# EAGLE schematic KGGRdac (EAGLE 8.2.1)

## Sheet 1 of 3
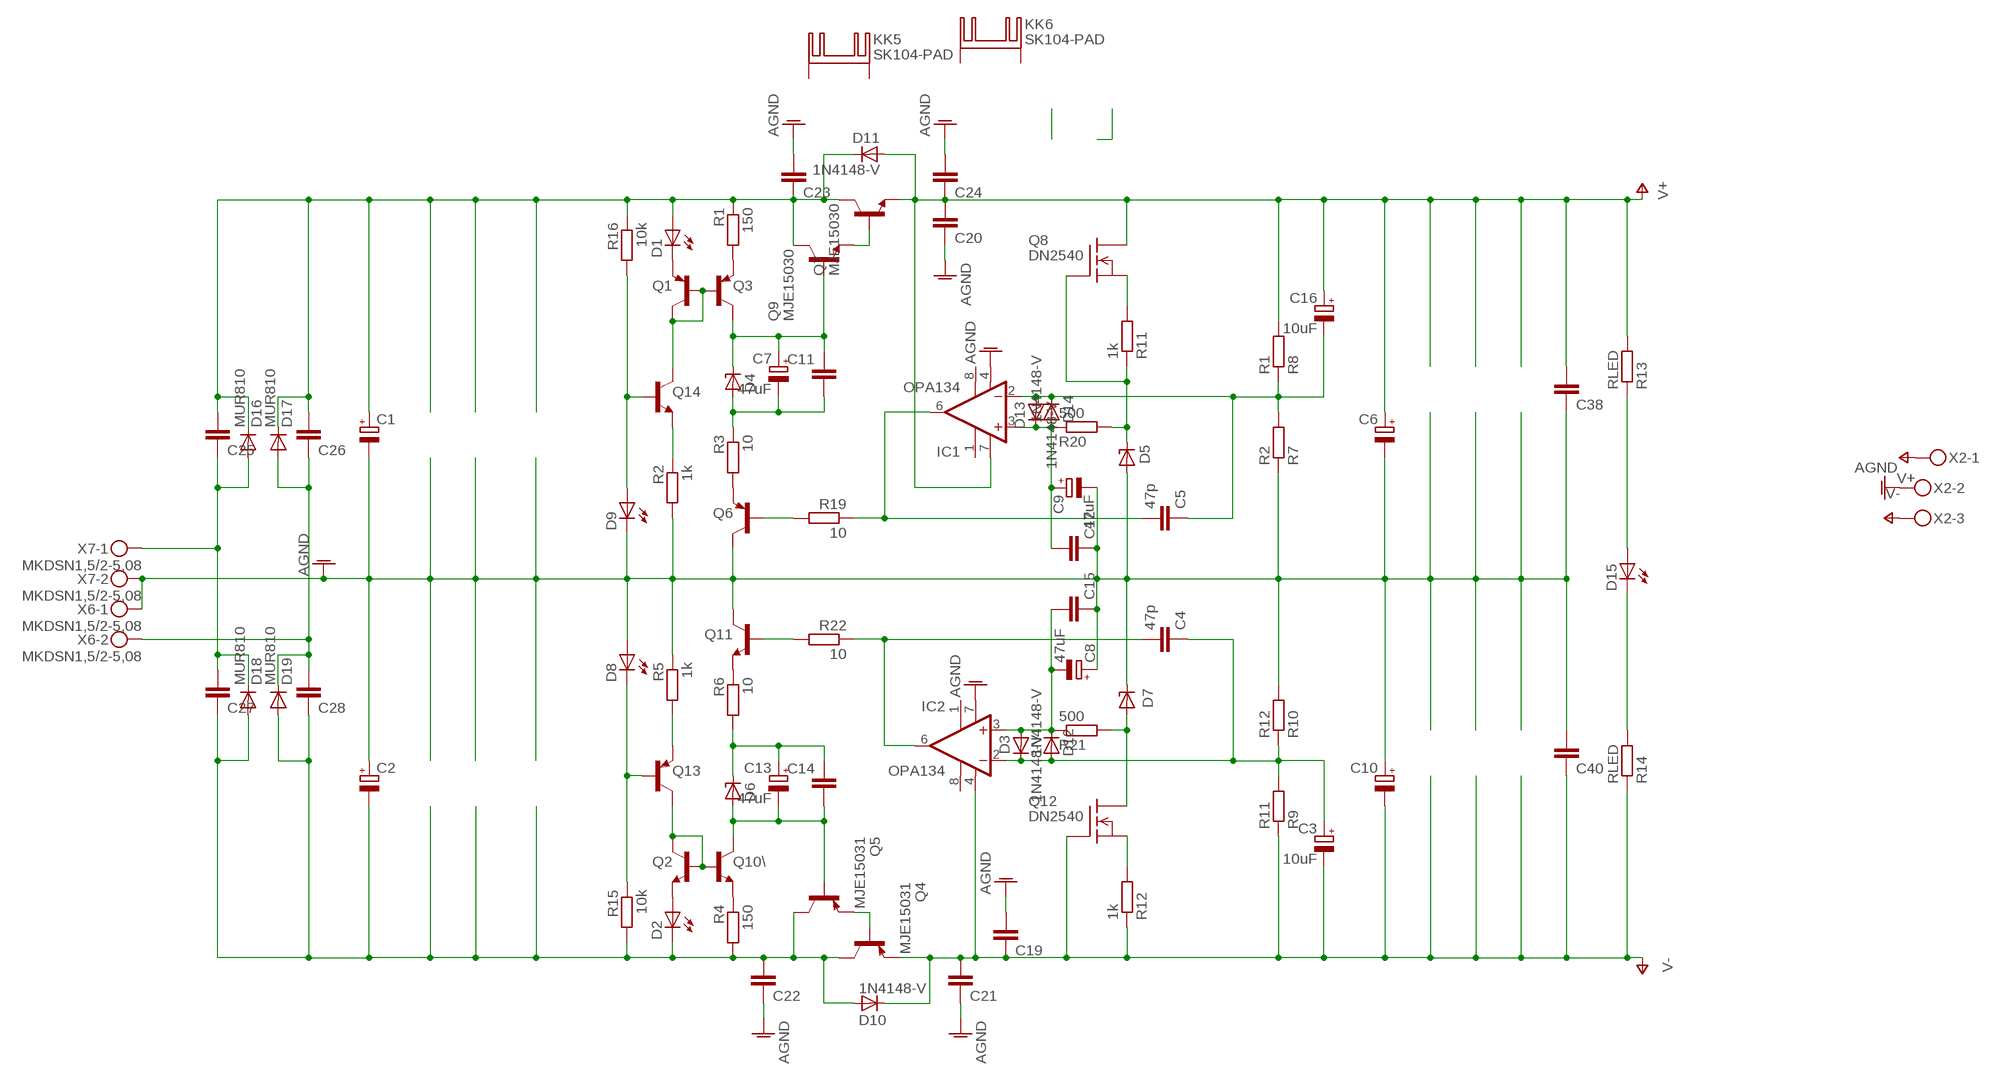
[diagram p0: schematic, sheet 1]

### Parts
C1  CPOL-EUE10-35  [EB35D]
C2  CPOL-EUE10-35  [EB35D]
C3  10uF  CPOL-EUSP-CAP-CX  [SP-CAP-CX]
C4  47p  C-EUC1206  [C1206]
C5  47p  C-EUC1206  [C1206]
C6  CPOL-EUE5-13  [E5-13]
C7  47uF  CPOL-EUSP-CAP-CX  [SP-CAP-CX]
C8  47uF  CPOL-EUSP-CAP-CX  [SP-CAP-CX]
C9  47uF  CPOL-EUSP-CAP-CX  [SP-CAP-CX]
C10  CPOL-EUE5-13  [E5-13]
C11  C-EUC1206  [C1206]
C12  C-EU050-035X075  [C050-035X075]
C13  47uF  CPOL-EUSP-CAP-CX  [SP-CAP-CX]
C14  C-EUC1206  [C1206]
C15  C-EU050-035X075  [C050-035X075]
C16  10uF  CPOL-EUSP-CAP-CX  [SP-CAP-CX]
C19  C-EU050-035X075  [C050-035X075]
C20  C-EU050-035X075  [C050-035X075]
C21  C-EU050-035X075  [C050-035X075]
C22  C-EU050-075X075  [C050-075X075]
C23  C-EU050-075X075  [C050-075X075]
C24  C-EU050-035X075  [C050-035X075]
C25  C-EU050-035X075  [C050-035X075]
C26  C-EU050-035X075  [C050-035X075]
C27  C-EU050-035X075  [C050-035X075]
C28  C-EU050-035X075  [C050-035X075]
C38  C-EU050-035X075  [C050-035X075]
C40  C-EU050-035X075  [C050-035X075]
D1  LED5MM  [LED5MM]
D2  LED5MM  [LED5MM]
D3  1N4148-V  [1N4148]
D4  1N4728  [DO41Z10]
D5  LT1021  LT1021-V  [DIL08]
D6  1N4728  [DO41Z10]
D7  LT1021  LT1021-V  [DIL08]
D8  LED5MM  [LED5MM]
D9  LED5MM  [LED5MM]
D10  1N4148-V  [1N4148]
D11  1N4148-V  [1N4148]
D12  1N4148-V  [1N4148]
D13  1N4148-V  [1N4148]
D14  1N4148-V  [1N4148]
D15  LED5MM  [LED5MM]
D16  MUR810  [TO220ACS]
D17  MUR810  [TO220ACS]
D18  MUR810  [TO220ACS]
D19  MUR810  [TO220ACS]
IC1  OPA134  OPA134P  [DIL08]
IC2  OPA134  OPA134P  [DIL08]
KK5  SK104-PAD  [SK104-PAD]
KK6  SK104-PAD  [SK104-PAD]
Q1  MPSA92-PNP-TO92-EBC  [TO92-EBC]
Q2  MPSA42-NPN-TO92-EBC  [TO92-EBC]
Q3  MPSA92-PNP-TO92-EBC  [TO92-EBC]
Q4  MJE15031  [TO220KG]
Q5  MJE15031  [TO220KG]
Q6  MPSA92-PNP-TO92-EBC  [TO92-EBC]
Q7  MJE15030  [TO220KG]
Q8  DN2540  2N7000TO92  [TO92-]
Q9  MJE15030  [TO220KG]
Q10\  MPSA42-NPN-TO92-EBC  [TO92-EBC]
Q11  MPSA42-NPN-TO92-EBC  [TO92-EBC]
Q12  DN2540  2N7000TO92  [TO92-]
Q13  MPSA92-PNP-TO92-EBC  [TO92-EBC]
Q14  MPSA42-NPN-TO92-EBC  [TO92-EBC]
R1  150  R-EU_0207/2V  [0207/2V]
R2  1k  R-EU_0207/2V  [0207/2V]
R3  10  R-EU_0207/2V  [0207/2V]
R4  150  R-EU_0207/2V  [0207/2V]
R5  1k  R-EU_0207/2V  [0207/2V]
R6  10  R-EU_0207/2V  [0207/2V]
R7  R2  R-EU_0207/2V  [0207/2V]
R8  R1  R-EU_0207/2V  [0207/2V]
R9  R11  R-EU_0207/2V  [0207/2V]
R10  R12  R-EU_0207/2V  [0207/2V]
R11  1k  R-EU_0207/2V  [0207/2V]
R12  1k  R-EU_0207/2V  [0207/2V]
R13  RLED  R-EU_0207/2V  [0207/2V]
R14  RLED  R-EU_0207/2V  [0207/2V]
R15  10k  R-EU_0207/2V  [0207/2V]
R16  10k  R-EU_0207/2V  [0207/2V]
R19  10  R-EU_0207/2V  [0207/2V]
R20  500  R-EU_0207/2V  [0207/2V]
R21  500  R-EU_0207/2V  [0207/2V]
R22  10  R-EU_0207/2V  [0207/2V]
X2  MKDSN1,5/3-5,08  [MKDSN1,5/3-5,08]
X6  MKDSN1,5/2-5,08  [MKDSN1,5/2-5,08]
X7  MKDSN1,5/2-5,08  [MKDSN1,5/2-5,08]

### Nets
AGND: C1.- C2.+ C6.- C8.+ C9.- C10.+ C12.1 C15.1 C19.2 C20.1 C21.1 C22.1 C23.2 C24.2 C38.1 C40.2 D5.4(GND) D7.6(OUT) D8.A D9.K(C) IC1.4(V-) IC2.7(V+) Q6.C Q11.C R2.2 R5.1 R7.1 R10.2 X2.2 X6.1 X7.2
N$1: Q1.B Q1.C Q3.B Q14.C
N$2: D1.K(C) Q1.E
N$3: Q3.E R1.2
N$4: C1.+ C23.1 C25.2 C26.2 D1.A D11.C D16.C D17.C Q7.2(C) Q9.2(C) R1.1 R16.1
N$5: C7.+ C11.1 D4.C Q3.C Q9.1(B)
N$6: C7.- C11.2 D4.A R3.1
N$7: Q6.E R3.2
N$8: Q14.E R2.1
N$9: D9.A Q14.B R16.2
N$10: C8.- C15.2 D3.A D12.C IC2.3(+IN) R21.1
N$11: Q13.E R5.2
N$12: D8.K(C) Q13.B R15.1
N$13: Q11.E R6.1
N$14: C13.+ C14.1 D6.C R6.2
N$15: C13.- C14.2 D6.A Q5.1(B) Q10\.C
N$16: Q2.B Q2.C Q10\.B Q13.C
N$17: Q4.1(B) Q5.3(E)
N$18: Q10\.E R4.1
N$19: D2.A Q2.E
N$21: Q7.1(B) Q9.3(E)
N$22: C2.- C22.2 C27.1 C28.1 D2.K(C) D10.A D18.A D19.A Q4.2(C) Q5.2(C) R4.2 R15.2
N$23: C25.1 C27.2 D16.A D18.C X7.1
N$24: C5.2 IC1.6(OUT) R19.1
N$25: C4.2 IC2.6(OUT) R22.1
N$26: Q11.B R22.2
N$27: Q6.B R19.2
N$28: C5.1 C16.- D13.A D14.C IC1.2(-IN) R7.2 R8.1
N$29: Q12.3(S) R12.2
N$30: D5.6(OUT) Q8.2(G) R11.1 R20.2
N$31: C9.+ C12.2 D13.C D14.A IC1.3(+IN) R20.1
N$32: D15.K(C) R14.2
N$33: D7.4(GND) Q12.1(D) R21.2
N$34: C3.+ C4.1 D3.C D12.A IC2.2(-IN) R9.2 R10.1
N$35: Q8.3(S) R11.2
N$36: D15.A R13.1
N$38: C26.1 C28.2 D17.A D19.C X6.2
V+: C6.+ C16.+ C20.2 C24.1 C38.2 D11.A IC1.7(V+) Q7.3(E) Q8.1(D) R8.2 R13.2 X2.1
V-: C3.- C10.- C19.1 C21.2 C40.1 D10.C IC2.4(V-) Q4.3(E) Q12.2(G) R9.1 R12.1 R14.1 X2.3
Unconnected: IC1.1(TRIM1) IC1.8(TRIM2) IC2.1(TRIM1) IC2.8(TRIM2) KK5.K1(K) KK5.K2(K) KK6.K1(K) KK6.K2(K)

## Sheet 2 of 3
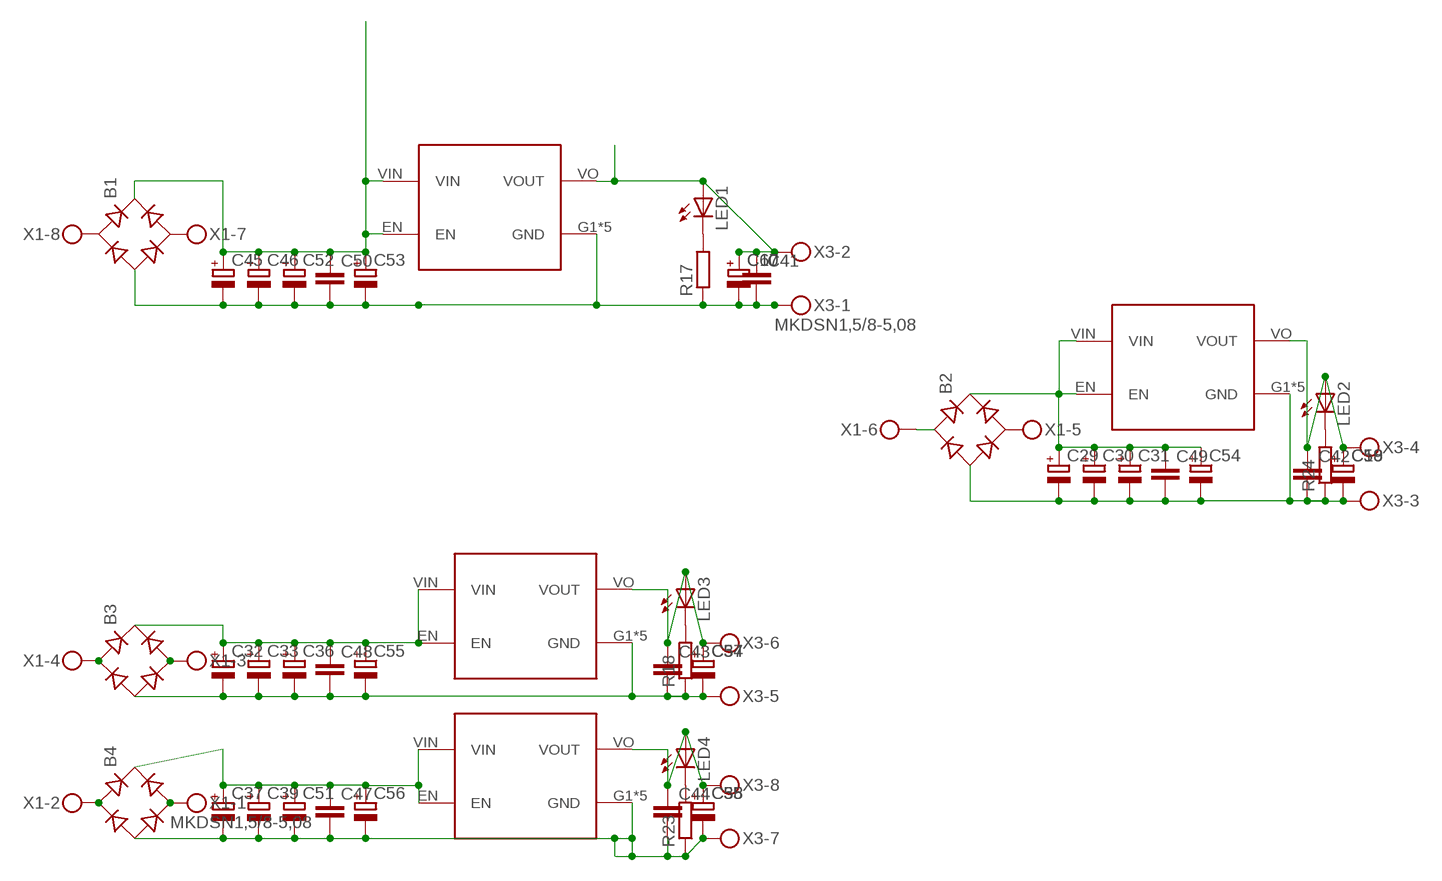
[diagram p1: schematic, sheet 2]

### Parts
B1  RB1A  [RB1A]
B2  RB1A  [RB1A]
B3  RB1A  [RB1A]
B4  RB1A  [RB1A]
C17  CPOL-EUSP-CAP-CX  [SP-CAP-CX]
C18  CPOL-EUSP-CAP-CX  [SP-CAP-CX]
C29  CPOL-EUSP-CAP-CX  [SP-CAP-CX]
C30  CPOL-EUSP-CAP-CX  [SP-CAP-CX]
C31  CPOL-EUSP-CAP-CX  [SP-CAP-CX]
C32  CPOL-EUSP-CAP-CX  [SP-CAP-CX]
C33  CPOL-EUSP-CAP-CX  [SP-CAP-CX]
C34  CPOL-EUSP-CAP-CX  [SP-CAP-CX]
C35  CPOL-EUSP-CAP-CX  [SP-CAP-CX]
C36  CPOL-EUSP-CAP-CX  [SP-CAP-CX]
C37  CPOL-EUSP-CAP-CX  [SP-CAP-CX]
C39  CPOL-EUSP-CAP-CX  [SP-CAP-CX]
C41  C-EUC1206  [C1206]
C42  C-EUC1206  [C1206]
C43  C-EUC1206  [C1206]
C44  C-EUC1206  [C1206]
C45  CPOL-EUSP-CAP-CX  [SP-CAP-CX]
C46  CPOL-EUSP-CAP-CX  [SP-CAP-CX]
C47  C-EUC1206  [C1206]
C48  C-EUC1206  [C1206]
C49  C-EUC1206  [C1206]
C50  C-EUC1206  [C1206]
C51  CPOL-EUSP-CAP-CX  [SP-CAP-CX]
C52  CPOL-EUSP-CAP-CX  [SP-CAP-CX]
C53  CPOL-EUSP-CAP-CX  [SP-CAP-CX]
C54  CPOL-EUSP-CAP-CX  [SP-CAP-CX]
C55  CPOL-EUSP-CAP-CX  [SP-CAP-CX]
C56  CPOL-EUSP-CAP-CX  [SP-CAP-CX]
C57  CPOL-EUSP-CAP-CX  [SP-CAP-CX]
C58  CPOL-EUSP-CAP-CX  [SP-CAP-CX]
C59  CPOL-EUSP-CAP-CX  [SP-CAP-CX]
C60  CPOL-EUSP-CAP-CX  [SP-CAP-CX]
LED1  LEDSML0805  [SML0805]
LED2  LEDSML0805  [SML0805]
LED3  LEDSML0805  [SML0805]
LED4  LEDSML0805  [SML0805]
R17  R-EU_MELF0204W  [MINI_MELF-0204W]
R18  R-EU_MELF0204W  [MINI_MELF-0204W]
R23  R-EU_MELF0204W  [MINI_MELF-0204W]
R24  R-EU_MELF0204W  [MINI_MELF-0204W]
U$3  POWER-MO  [POWER-MO]
U$4  POWER-MO  [POWER-MO]
U$5  POWER-MO  [POWER-MO]
U$6  POWER-MO  [POWER-MO]
X1  MKDSN1,5/8-5,08  [MKDSN1,5/8-5,08]
X3  MKDSN1,5/8-5,08  [MKDSN1,5/8-5,08]

### Nets
N$43: B2.+ C29.+ C30.+ C31.+ C49.1 C54.+ U$3.EN U$3.VIN
N$44: B2.- C18.- C29.- C30.- C31.- C42.2 C49.2 C54.- C59.- R24.1 U$3.G1(GND) U$3.G2(GND) U$3.G3(GND) U$3.G4(GND) U$3.G5(GND) X3.3
N$46: B4.+ C37.+ C39.+ C47.1 C51.+ C56.+ U$6.EN U$6.VIN
N$47: B4.- C35.- C37.- C39.- C44.2 C47.2 C51.- C56.- C58.- R23.1 U$6.G1(GND) U$6.G2(GND) U$6.G3(GND) U$6.G4(GND) U$6.G5(GND) X3.7
N$48: C35.+ C44.1 C58.+ LED4.A U$6.VO(VOUT) X3.8
N$49: C34.+ C43.1 C57.+ LED3.A U$5.VO(VOUT) X3.6
N$50: C18.+ C42.1 C59.+ LED2.A U$3.VO(VOUT) X3.4
N$51: B3.AC1 X1.4
N$52: B3.AC2 X1.3
N$53: B4.AC1 X1.2
N$54: B4.AC2 X1.1
N$55: B3.- C32.- C33.- C34.- C36.- C43.2 C48.2 C55.- C57.- R18.1 U$5.G1(GND) U$5.G2(GND) U$5.G3(GND) U$5.G4(GND) U$5.G5(GND) X3.5
N$56: B1.AC2 X1.7
N$57: B1.AC1 X1.8
N$58: B1.+ C45.+ C46.+ C50.1 C52.+ C53.+ U$4.EN U$4.VIN
N$59: B2.AC2 X1.5
N$61: B2.AC1 X1.6
N$62: B3.+ C32.+ C33.+ C36.+ C48.1 C55.+ U$5.EN U$5.VIN
N$65: B1.- C17.- C41.2 C45.- C46.- C50.2 C52.- C53.- C60.- R17.1 U$4.G1(GND) U$4.G2(GND) U$4.G3(GND) U$4.G4(GND) U$4.G5(GND) X3.1
N$66: C17.+ C41.1 C60.+ LED1.A U$4.VO(VOUT) X3.2
N$67: LED1.C R17.2
N$71: LED4.C R23.2
N$72: LED3.C R18.2
N$73: LED2.C R24.2

## Sheet 3 of 3
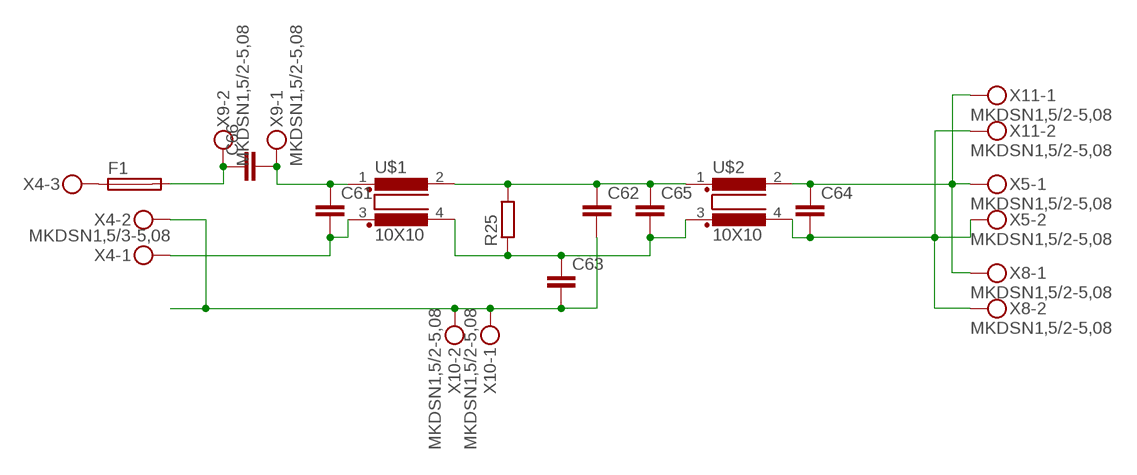
[diagram p2: schematic, sheet 3]

### Parts
C61  C-EU225-087X268  [C225-087X268]
C62  C-EU102-054X133  [C102-054X133]
C63  C-EU102-054X133  [C102-054X133]
C64  C-EU225-087X268  [C225-087X268]
C65  C-EU225-087X268  [C225-087X268]
C66  C-EU075-042X103  [C075-042X103]
F1  SH22,5A  [SH22,5A]
R25  R-EU_0411/15  [0411/15]
U$1  10X10  [10X10]
U$2  10X10  [10X10]
X4  MKDSN1,5/3-5,08  [MKDSN1,5/3-5,08]
X5  MKDSN1,5/2-5,08  [MKDSN1,5/2-5,08]
X8  MKDSN1,5/2-5,08  [MKDSN1,5/2-5,08]
X9  MKDSN1,5/2-5,08  [MKDSN1,5/2-5,08]
X10  MKDSN1,5/2-5,08  [MKDSN1,5/2-5,08]
X11  MKDSN1,5/2-5,08  [MKDSN1,5/2-5,08]

### Nets
N$45: F1.1 X4.3
N$68: C62.1 C65.1 R25.2 U$1.2 U$2.1
N$69: C62.2 C63.2 X4.2 X10.1 X10.2
N$70: C63.1 C65.2 R25.1 U$1.4 U$2.3
N$75: C64.2 U$2.4 X5.2 X8.2 X11.2
N$76: C61.2 U$1.3 X4.1
N$77: C66.1 F1.2 X9.2
N$78: C64.1 U$2.2 X5.1 X8.1 X11.1
N$79: C61.1 C66.2 U$1.1 X9.1

## Library data of the parts
B1-B4 = rectifier:RB1A: RECTIFIER 1 A
C1-C3 C6-C10 C13 C16-C18 C29-C37 C39 C45 C46 C51-C60 = Vwvwbg:CPOL-EU: POLARIZED CAPACITOR, European symbol
C4 C5 C11 C12 C14 C15 C19-C28 C38 C40-C44 C47-C50 C61-C66 = Vwvwbg:C-EU: CAPACITOR, European symbol
D1 D2 D8 D9 D15 LED1-LED4 = led:LED: LED OSRAM: - CHIPLED LG R971, LG N971, LY N971, LG Q971, LY Q971, LO R971, LY R971 LH N974, LH R974 LS Q976, LO Q976, LY Q976 LO Q996 - Hyper CHIPLED LW Q18S LB Q993, LB Q99A, LB R99A - SideLED LS A670, LO A670, LY A670, LG A670, LP A670 LB A673, LV A673, LT A673, LW A673 LH A674 LY A675 LS A676, LA A676, LO A676, LY A676, LW A676 LS A679, LY A679, LG A679 - Hyper Micro SIDELED® LS Y876, LA Y876, LO Y876, LY Y876 LT Y87S - SmartLED LW L88C, LW L88S LB L89C, LB L89S, LG L890 LS L89K, LO L89K, LY L89K LS L896, LA L896, LO L896, LY L896 - TOPLED LS T670, LO T670, LY T670, LG T670, LP T670 LSG T670, LSP T670, LSY T670, LOP T670, LYG T670 LG T671, LOG T671, LSG T671 LB T673, LV T673, LT T673, LW T673 LH T674 LS T676, LA T676, LO T676, LY T676, LB T676, LH T676, LSB T676, LW T676 LB T67C, LV T67C, LT T67C, LS T67K, LO T67K, LY T67K, LW E67C LS E67B, LA E67B, LO E67B, LY E67B, LB E67C, LV E67C, LT E67C LW T67C LS T679, LY T679, LG T679 LS T770, LO T770, LY T770, LG T770, LP T770 LB T773, LV T773, LT T773, LW T773 LH T774 LS E675, LA E675, LY E675, LS T675 LS T776, LA T776, LO T776, LY T776, LB T776 LHGB T686 LT T68C, LB T68C - Hyper Mini TOPLED® LB M676 - Mini TOPLED Santana® LG M470 LS M47K, LO M47K, LY M47K Source: http://www.osram.convergy.de LUXEON: - LUMILED® LXK2-PW12-R00, LXK2-PW12-S00, LXK2-PW14-U00, LXK2-PW14-V00 LXK2-PM12-R00, LXK2-PM12-S00, LXK2-PM14-U00 LXK2-PE12-Q00, LXK2-PE12-R00, LXK2-PE12-S00, LXK2-PE14-T00, LXK2-PE14-U00 LXK2-PB12-K00, LXK2-PB12-L00, LXK2-PB12-M00, LXK2-PB14-N00, LXK2-PB14-P00, LXK2-PB14-Q00 LXK2-PR12-L00, LXK2-PR12-M00, LXK2-PR14-Q00, LXK2-PR14-R00 LXK2-PD12-Q00, LXK2-PD12-R00, LXK2-PD12-S00 LXK2-PH12-R00, LXK2-PH12-S00 LXK2-PL12-P00, LXK2-PL12-Q00, LXK2-PL12-R00 Source: www.luxeon.com KINGBRIGHT: KA-3528ASYC Source: www.kingbright.com
D3 D10-D14 = diode:1N4148-V
D4 D6 = diode:1N4728: Z DIODE 3.3 V, 1W, 5 percent
D5 D7 = linear-technology:LT1021-V
D16-D19 = diode:MUR810: DIODE
F1 = fuse:SH22,5A: FUSE HOLDER grid 22,5mm, isolated cap OGN0031 8201, Schurter (Buerklin); MPN: 0031.7701.11; OC_FARNELL: unknown; OC_NEWARK: 04F1224
IC1 IC2 = burr-brown:OPA134: Operational Amplifiers SoundPlus(TM) High Performance Audio; MF: TEXAS INSTRUMENTS; MPN: OPA134PA; OC_FARNELL: 1335032; OC_NEWARK: 75C4599
KK5 KK6 = heatsink:SK104-PAD: HEATSINK manufacturer Fischer/distributor Buerklin
Q1 Q3 Q6 Q13 = transistor:*-PNP-: PNP Transistror
Q2 Q10\ Q11 Q14 = transistor:*-NPN-: NPN Transistror BF959 corrected 2008.03.06
Q4 Q5 = transistor:MJE15031
Q7 Q9 = transistor:MJE15030
Q8 Q12 = tranzistory FET:2N7000
R1-R25 = Vwvwbg:R-EU_: RESISTOR, European symbol
U$1 U$2 = inductors:10X10
U$3-U$6 = Vwvwbg:POWER-MO
X1 X3 = con-phoenix-508:MKDSN1,5/8-5,08: MKDSN 1,5/ 8-5,08 Printklemme Nennstrom: 13,5 A Nennspannung: 250 V Rastermaß: 5,08 mm Polzahl: 8 Anschlussart: Schraubanschluss Montage: Löten Anschlussrichtung Leiter/Platine: 0 ° Artikelnummer: 1729186 Source: http://eshop.phoenixcontact.com .. 1729186.pdf
X2 X4 = con-phoenix-508:MKDSN1,5/3-5,08: MKDSN 1,5/ 3-5,08 Printklemme Nennstrom: 13,5 A Nennspannung: 250 V Rastermaß: 5,08 mm Polzahl: 3 Anschlussart: Schraubanschluss Montage: Löten Anschlussrichtung Leiter/Platine: 0 ° Artikelnummer: 1729131 Source: http://eshop.phoenixcontact.com .. 1729131.pdf
X5-X11 = con-phoenix-508:MKDSN1,5/2-5,08: MKDSN 1,5/ 2-5,08 Printklemme Nennstrom: 13,5 A Nennspannung: 250 V Rastermaß: 5,08 mm Polzahl: 2 Anschlussart: Schraubanschluss Montage: Löten Anschlussrichtung Leiter/Platine: 0 ° Artikelnummer: 1729128 Source: http://eshop.phoenixcontact.com .. 1729128.pdf